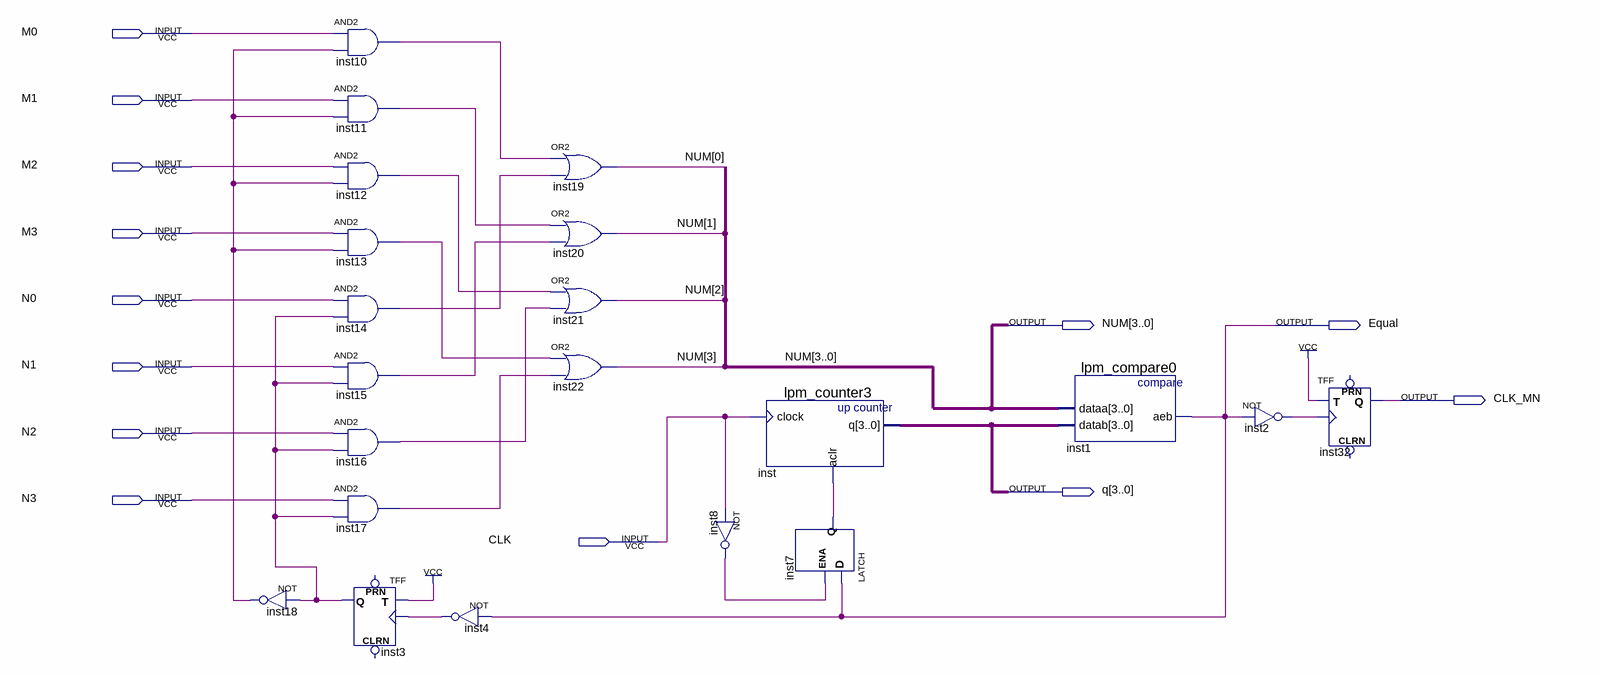
[diagram p0: schematic sheet]
// Quartus schematic lab2.bdf as structural Verilog: 21 symbols, 13 pins
module lab2 (
  input  M0,
  input  M1,
  input  M2,
  input  M3,
  input  N0,
  input  N1,
  input  N2,
  input  N3,
  input  CLK,
  output [3:0] NUM,
  output Equal,
  output CLK_MN,
  output [3:0] q
);

  wire inst2_out, inst3_q, inst4_out, inst7_q, inst8_out, inst10_out, inst11_out, inst12_out, inst13_out,
       inst14_out, inst15_out, inst16_out, inst17_out, inst18_out;

  not inst18 (inst18_out, inst3_q);
  and inst10 (inst10_out, M0, inst18_out);
  and inst11 (inst11_out, M1, inst18_out);
  and inst12 (inst12_out, M2, inst18_out);
  and inst13 (inst13_out, M3, inst18_out);
  and inst14 (inst14_out, N0, inst3_q);
  and inst15 (inst15_out, N1, inst3_q);
  and inst16 (inst16_out, N2, inst3_q);
  and inst17 (inst17_out, N3, inst3_q);
  TFF inst3 (.T(1'b1), .CLK(inst4_out), .Q(inst3_q));  // open: PRN, CLRN
  not inst4 (inst4_out, Equal);
  or inst19 (NUM[0], inst10_out, inst14_out);
  or inst20 (NUM[1], inst11_out, inst15_out);
  or inst21 (NUM[2], inst12_out, inst16_out);
  or inst22 (NUM[3], inst13_out, inst17_out);
  not inst8 (inst8_out, CLK);
  lpm_counter3 inst (.clock(CLK), .aclr(inst7_q), .q(q));
  LATCH inst7 (.D(Equal), .ENA(inst8_out), .Q(inst7_q));
  lpm_compare0 inst1 (.dataa(NUM), .datab(q), .aeb(Equal));
  not inst2 (inst2_out, Equal);
  TFF inst32 (.T(1'b1), .CLK(inst2_out), .Q(CLK_MN));  // open: PRN, CLRN
endmodule
